# EAGLE design PCB-CMB-4x (EAGLE 7.1.0)

## Sheet 1 of 2
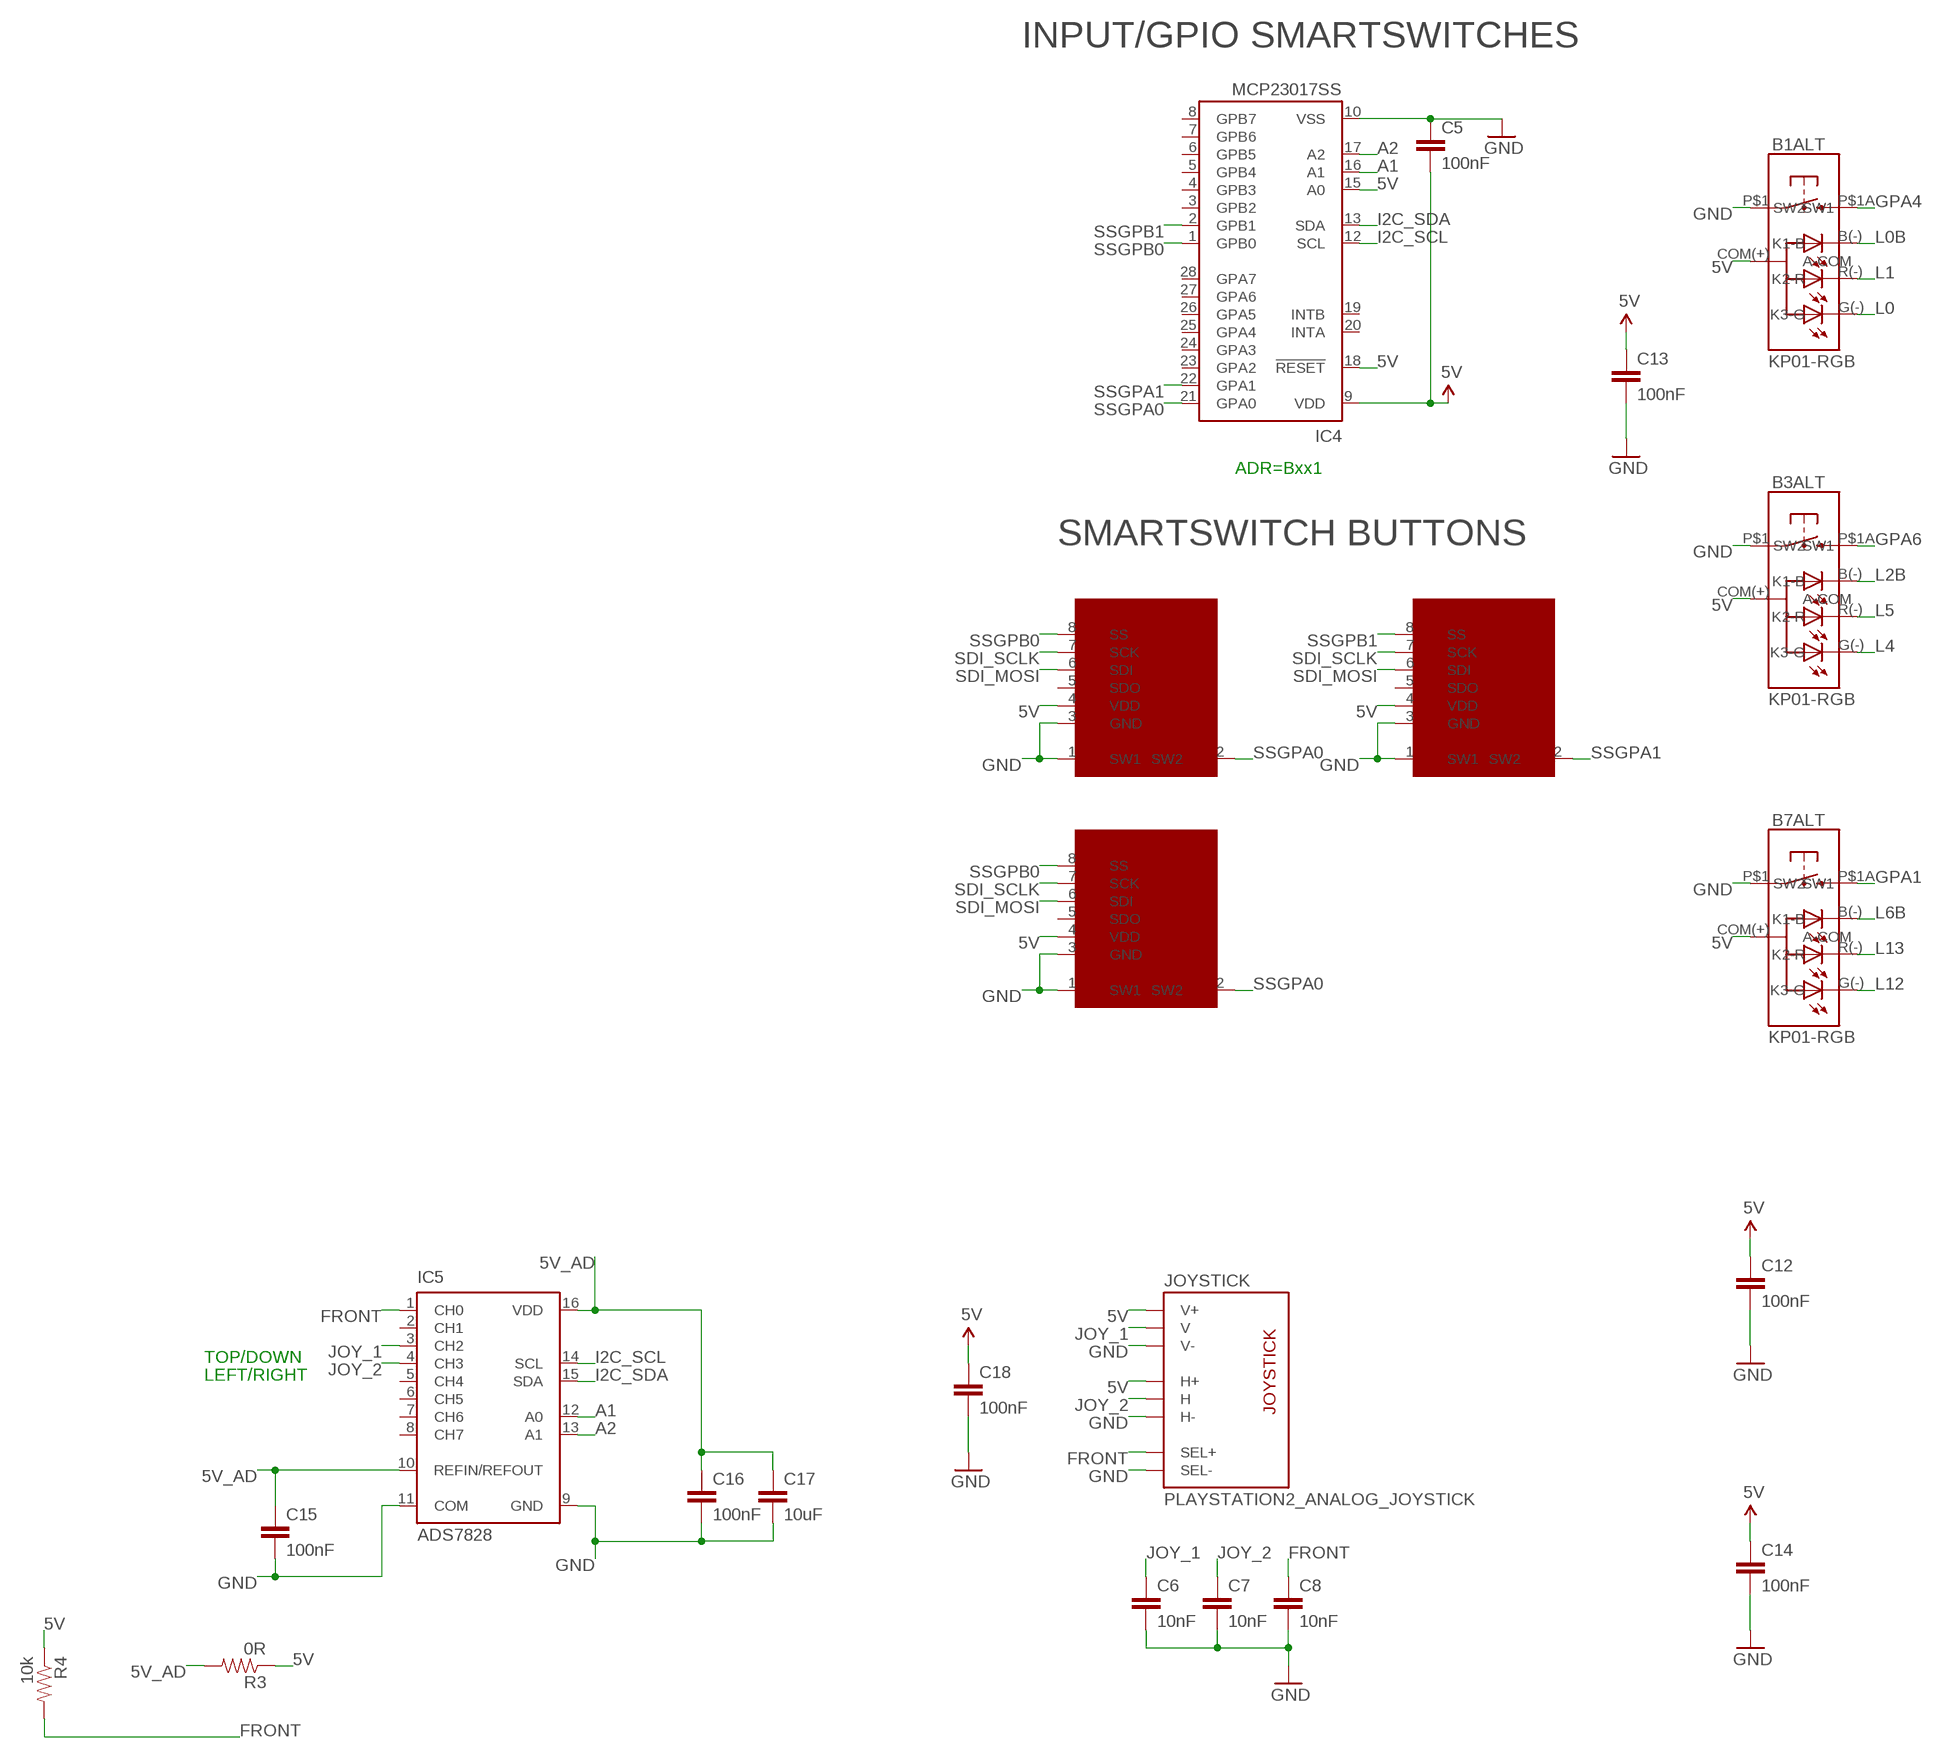
[diagram p0: schematic, sheet 1, part 1 of 2]
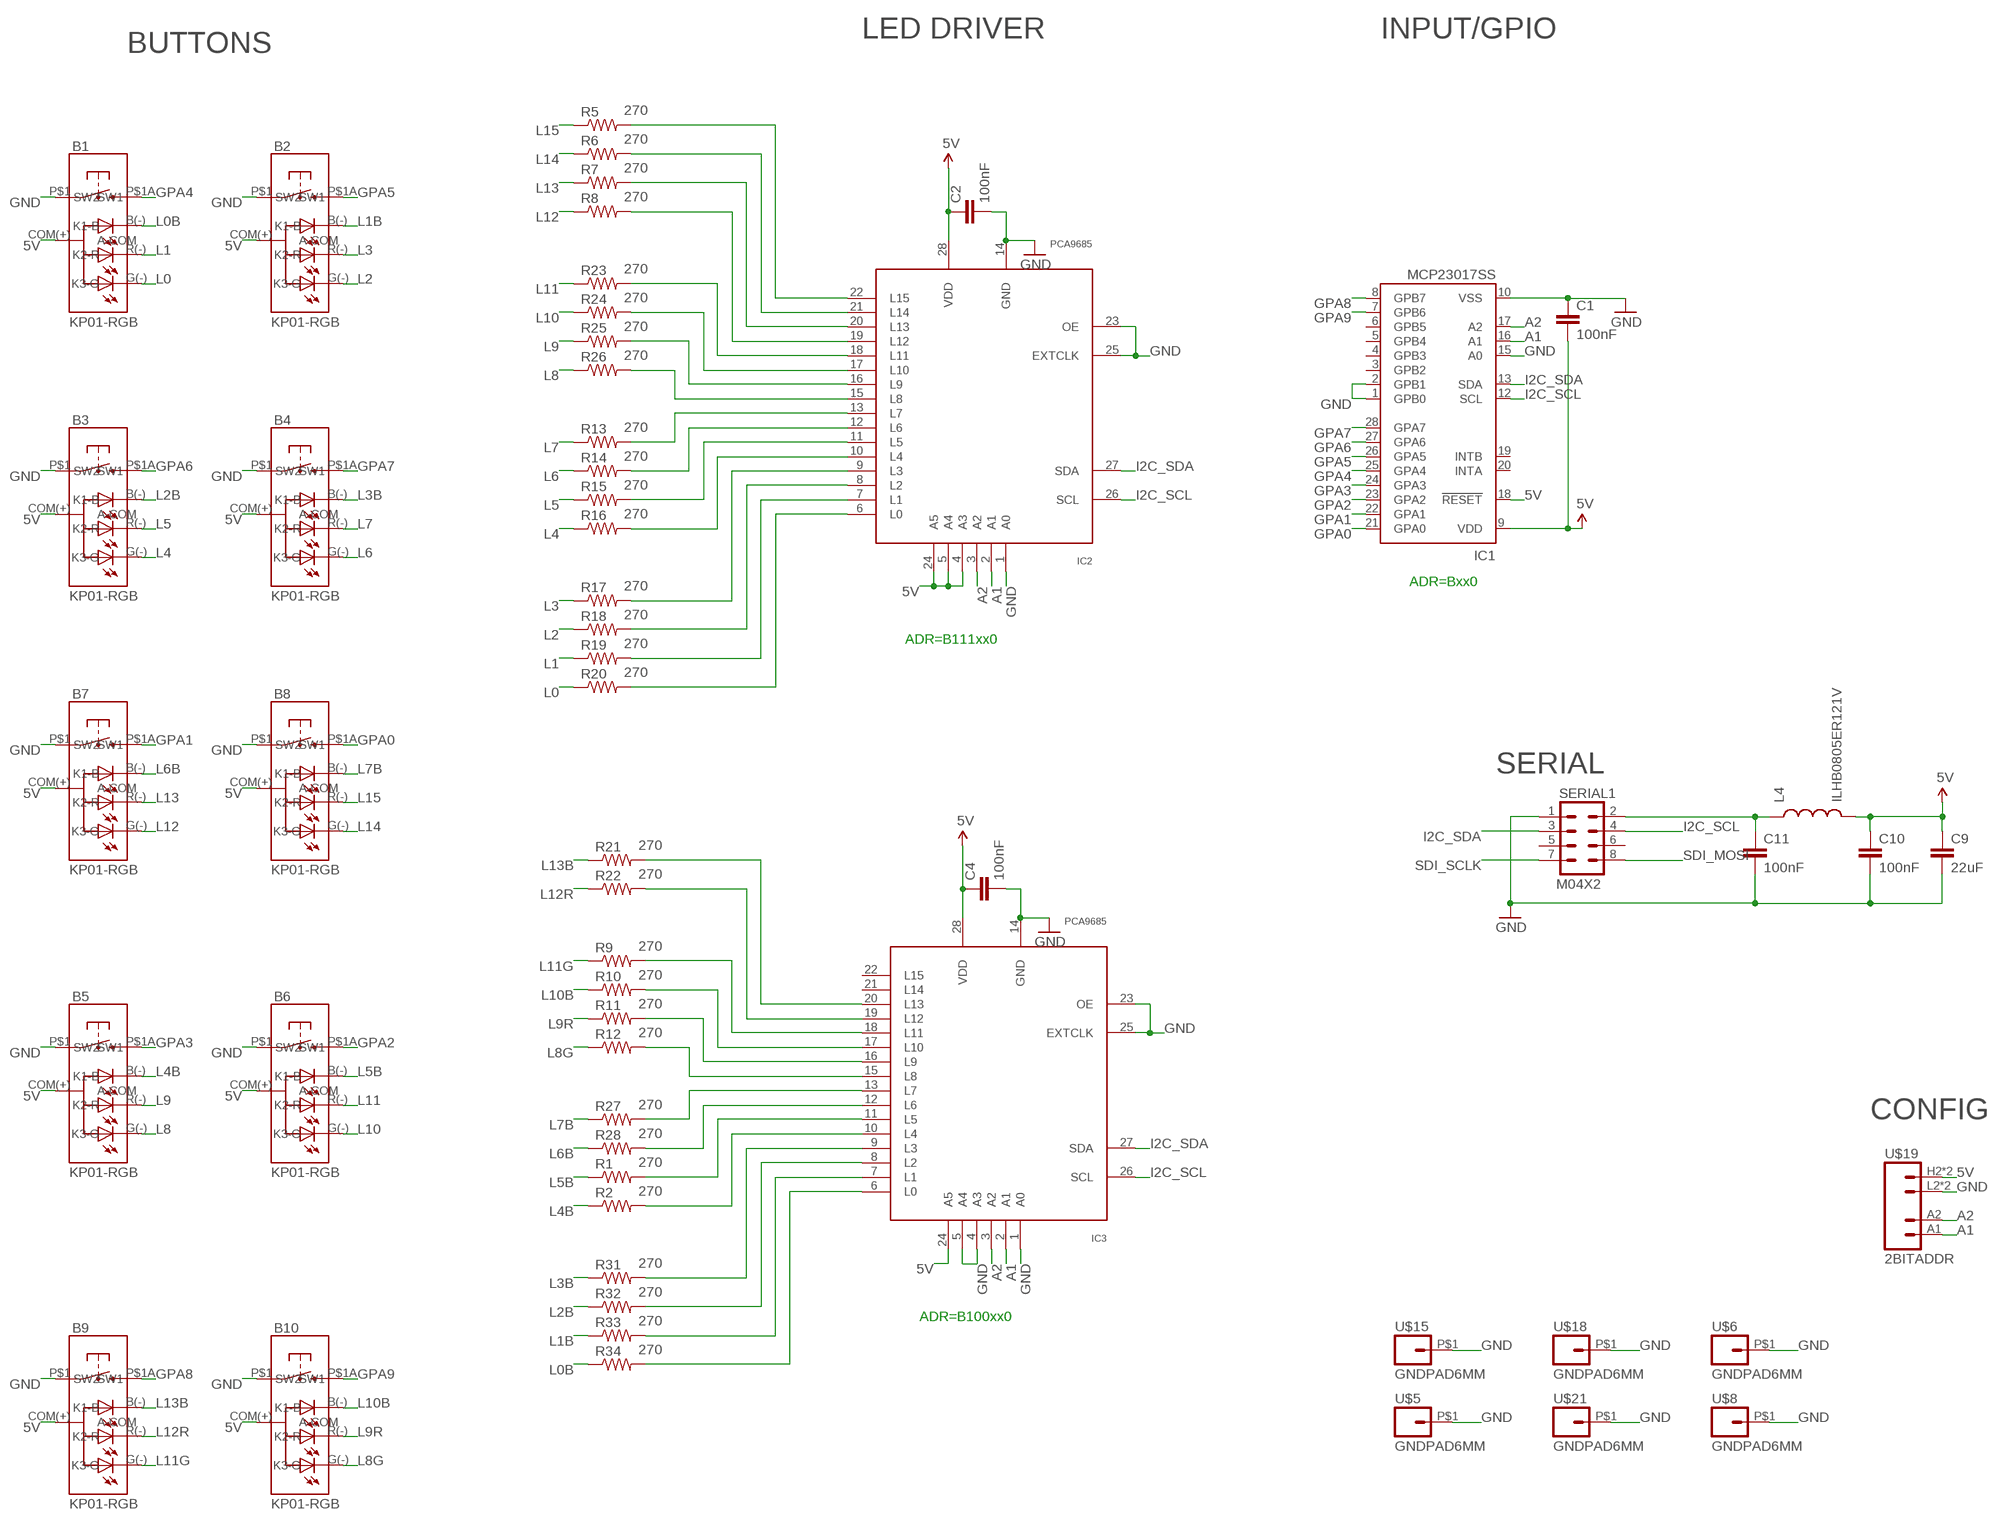
[diagram p1: schematic, sheet 1, part 2 of 2]

### Parts
B1  KP01-RGB  NKK-KP01  [NKK-KP01]
B1ALT  KP01-RGB  NKK-KP01  [NKK-KP01]
B2  KP01-RGB  NKK-KP01  [NKK-KP01]
B3  KP01-RGB  NKK-KP01  [NKK-KP01]
B3ALT  KP01-RGB  NKK-KP01  [NKK-KP01]
B4  KP01-RGB  NKK-KP01  [NKK-KP01]
B5  KP01-RGB  NKK-KP01  [NKK-KP01]
B6  KP01-RGB  NKK-KP01  [NKK-KP01]
B7  KP01-RGB  NKK-KP01  [NKK-KP01]
B7ALT  KP01-RGB  NKK-KP01  [NKK-KP01]
B8  KP01-RGB  NKK-KP01  [NKK-KP01]
B9  KP01-RGB  NKK-KP01  [NKK-KP01]
B10  KP01-RGB  NKK-KP01  [NKK-KP01]
C1  100nF  CAP0603-CAP  [0603-CAP]
C2  100nF  CAP0603-CAP  [0603-CAP]
C4  100nF  CAP0603-CAP  [0603-CAP]
C5  100nF  CAP0603-CAP  [0603-CAP]
C6  10nF  CAP0603-CAP  [0603-CAP]
C7  10nF  CAP0603-CAP  [0603-CAP]
C8  10nF  CAP0603-CAP  [0603-CAP]
C9  22uF  CAP0805  [0805]
C10  100nF  CAP0603-CAP  [0603-CAP]
C11  100nF  CAP0603-CAP  [0603-CAP]
C12  100nF  CAP0603-CAP  [0603-CAP]
C13  100nF  CAP0603-CAP  [0603-CAP]
C14  100nF  CAP0603-CAP  [0603-CAP]
C15  100nF  CAP0603-CAP  [0603-CAP]
C16  100nF  CAP0603-CAP  [0603-CAP]
C17  10uF  CAP0805  [0805]
C18  100nF  CAP0603-CAP  [0603-CAP]
IC1  MCP23017SS  [SSOP28]
IC2  PCA9685  [TSSOP28]
IC3  PCA9685  [TSSOP28]
IC4  MCP23017SS  [SSOP28]
IC5  ADS7828  [TSSOP16-PW]
JOYSTICK  PLAYSTATION2_ANALOG_JOYSTICK  [PLAYSTATION2_ANALOG_JOYSTICK]
L4  ILHB0805ER121V  INDUCTOR0805  [0805]
R1  270  RESISTOR0603-RES  [0603-RES]
R2  270  RESISTOR0603-RES  [0603-RES]
R3  0R  RESISTOR0603-RES  [0603-RES]
R4  10k  RESISTOR0603-RES  [0603-RES]
R5  270  RESISTOR0603-RES  [0603-RES]
R6  270  RESISTOR0603-RES  [0603-RES]
R7  270  RESISTOR0603-RES  [0603-RES]
R8  270  RESISTOR0603-RES  [0603-RES]
R9  270  RESISTOR0603-RES  [0603-RES]
R10  270  RESISTOR0603-RES  [0603-RES]
R11  270  RESISTOR0603-RES  [0603-RES]
R12  270  RESISTOR0603-RES  [0603-RES]
R13  270  RESISTOR0603-RES  [0603-RES]
R14  270  RESISTOR0603-RES  [0603-RES]
R15  270  RESISTOR0603-RES  [0603-RES]
R16  270  RESISTOR0603-RES  [0603-RES]
R17  270  RESISTOR0603-RES  [0603-RES]
R18  270  RESISTOR0603-RES  [0603-RES]
R19  270  RESISTOR0603-RES  [0603-RES]
R20  270  RESISTOR0603-RES  [0603-RES]
R21  270  RESISTOR0603-RES  [0603-RES]
R22  270  RESISTOR0603-RES  [0603-RES]
R23  270  RESISTOR0603-RES  [0603-RES]
R24  270  RESISTOR0603-RES  [0603-RES]
R25  270  RESISTOR0603-RES  [0603-RES]
R26  270  RESISTOR0603-RES  [0603-RES]
R27  270  RESISTOR0603-RES  [0603-RES]
R28  270  RESISTOR0603-RES  [0603-RES]
R31  270  RESISTOR0603-RES  [0603-RES]
R32  270  RESISTOR0603-RES  [0603-RES]
R33  270  RESISTOR0603-RES  [0603-RES]
R34  270  RESISTOR0603-RES  [0603-RES]
SERIAL1  M04X2  [2X4]
SSW1  SMART_SWITCHSMART_SWITCH_8PIN  [SMART_SWITCH]
SSW1ALT  SMART_SWITCHSMART_SWITCH_8PIN  [SMART_SWITCH]
SSW2  SMART_SWITCHSMART_SWITCH_8PIN  [SMART_SWITCH]
U$5  GNDPAD6MM  [3.2MMPAD6MM]
U$6  GNDPAD6MM  [3.2MMPAD6MM]
U$8  GNDPAD6MM  [3.2MMPAD6MM]
U$15  GNDPAD6MM  [3.2MMPAD6MM]
U$18  GNDPAD6MM  [3.2MMPAD6MM]
U$19  2BITADDR  [2BITADDR]
U$21  GNDPAD6MM  [3.2MMPAD6MM]

### Nets
5V [Power]: B1.COM(+)(A-COM) B1ALT.COM(+)(A-COM) B2.COM(+)(A-COM) B3.COM(+)(A-COM) B3ALT.COM(+)(A-COM) B4.COM(+)(A-COM) B5.COM(+)(A-COM) B6.COM(+)(A-COM) B7.COM(+)(A-COM) B7ALT.COM(+)(A-COM) B8.COM(+)(A-COM) B9.COM(+)(A-COM) B10.COM(+)(A-COM) C1.2 C2.1 C4.1 C5.2 C9.1 C10.1 C12.1 C13.1 C14.1 C18.1 IC1.9(VDD) IC1.18(!RESET) IC2.4(A3) IC2.5(A4) IC2.24(A5) IC2.28(VDD) IC3.24(A5) IC3.28(VDD) IC4.9(VDD) IC4.15(A0) IC4.18(!RESET) JOYSTICK.H1(H+) JOYSTICK.V1(V+) L4.2 R3.1 R4.1 SSW1.4(VDD) SSW1ALT.4(VDD) SSW2.4(VDD) U$19.H2(VCC) U$19.H3(VCC)
5V_AD [Power]: C15.1 C16.1 C17.1 IC5.10(REFIN/REFOUT) IC5.16(VDD) R3.2
A1: IC1.16(A1) IC2.2(A1) IC3.2(A1) IC4.16(A1) IC5.12(A0) U$19.A1
A2: IC1.17(A2) IC2.3(A2) IC3.3(A2) IC4.17(A2) IC5.13(A1) U$19.A2
FRONT: C8.1 IC5.1(CH0) JOYSTICK.B1A(SEL+) R4.2
GND [Power]: B1.P$1(SW1) B1ALT.P$1(SW1) B2.P$1(SW1) B3.P$1(SW1) B3ALT.P$1(SW1) B4.P$1(SW1) B5.P$1(SW1) B6.P$1(SW1) B7.P$1(SW1) B7ALT.P$1(SW1) B8.P$1(SW1) B9.P$1(SW1) B10.P$1(SW1) C1.1 C2.2 C4.2 C5.1 C6.2 C7.2 C8.2 C9.2 C10.2 C11.2 C12.2 C13.2 C14.2 C15.2 C16.2 C17.2 C18.2 IC1.1(GPB0) IC1.2(GPB1) IC1.10(VSS) IC1.15(A0) IC2.1(A0) IC2.14(GND) IC2.23(OE) IC2.25(EXTCLK) IC3.1(A0) IC3.4(A3) IC3.5(A4) IC3.14(GND) IC3.23(OE) IC3.25(EXTCLK) IC4.10(VSS) IC5.9(GND) IC5.11(COM) JOYSTICK.B2A(SEL-) JOYSTICK.H3(H-) JOYSTICK.V3(V-) SERIAL1.1 SSW1.1(SW1) SSW1.3(GND) SSW1ALT.1(SW1) SSW1ALT.3(GND) SSW2.1(SW1) SSW2.3(GND) U$5.P$1 U$6.P$1 U$8.P$1 U$15.P$1 U$18.P$1 U$19.L2(GND) U$19.L3(GND) U$21.P$1
GPA0: B8.P$1A(SW2) IC1.21(GPA0)
GPA1: B7.P$1A(SW2) B7ALT.P$1A(SW2) IC1.22(GPA1)
GPA2: B6.P$1A(SW2) IC1.23(GPA2)
GPA3: B5.P$1A(SW2) IC1.24(GPA3)
GPA4: B1.P$1A(SW2) B1ALT.P$1A(SW2) IC1.25(GPA4)
GPA5: B2.P$1A(SW2) IC1.26(GPA5)
GPA6: B3.P$1A(SW2) B3ALT.P$1A(SW2) IC1.27(GPA6)
GPA7: B4.P$1A(SW2) IC1.28(GPA7)
GPA8: B9.P$1A(SW2) IC1.8(GPB7)
GPA9: B10.P$1A(SW2) IC1.7(GPB6)
I2C_SCL: IC1.12(SCL) IC2.26(SCL) IC3.26(SCL) IC4.12(SCL) IC5.14(SCL) SERIAL1.4
I2C_SDA: IC1.13(SDA) IC2.27(SDA) IC3.27(SDA) IC4.13(SDA) IC5.15(SDA) SERIAL1.3
JOY_1: C6.1 IC5.3(CH2) JOYSTICK.V2(V)
JOY_2: C7.1 IC5.4(CH3) JOYSTICK.H2(H)
L0: B1.G(-)(K3-G) B1ALT.G(-)(K3-G) R20.1
L0B: B1.B(-)(K1-B) B1ALT.B(-)(K1-B) R34.1
L1: B1.R(-)(K2-R) B1ALT.R(-)(K2-R) R19.1
L1B: B2.B(-)(K1-B) R33.1
L2: B2.G(-)(K3-G) R18.1
L2B: B3.B(-)(K1-B) B3ALT.B(-)(K1-B) R32.1
L3: B2.R(-)(K2-R) R17.1
L3B: B4.B(-)(K1-B) R31.1
L4: B3.G(-)(K3-G) B3ALT.G(-)(K3-G) R16.1
L4B: B5.B(-)(K1-B) R2.1
L5: B3.R(-)(K2-R) B3ALT.R(-)(K2-R) R15.1
L5B: B6.B(-)(K1-B) R1.1
L6: B4.G(-)(K3-G) R14.1
L6B: B7.B(-)(K1-B) B7ALT.B(-)(K1-B) R28.1
L7: B4.R(-)(K2-R) R13.1
L7B: B8.B(-)(K1-B) R27.1
L8: B5.G(-)(K3-G) R26.1
L8G: B10.G(-)(K3-G) R12.1
L9: B5.R(-)(K2-R) R25.1
L9R: B10.R(-)(K2-R) R11.1
L10: B6.G(-)(K3-G) R24.1
L10B: B10.B(-)(K1-B) R10.1
L11: B6.R(-)(K2-R) R23.1
L11G: B9.G(-)(K3-G) R9.1
L12: B7.G(-)(K3-G) B7ALT.G(-)(K3-G) R8.1
L12R: B9.R(-)(K2-R) R22.1
L13: B7.R(-)(K2-R) B7ALT.R(-)(K2-R) R7.1
L13B: B9.B(-)(K1-B) R21.1
L14: B8.G(-)(K3-G) R6.1
L15: B8.R(-)(K2-R) R5.1
N$1 [Power]: C11.1 L4.1 SERIAL1.2
N$2: IC3.13(L7) R27.2
N$3: IC3.12(L6) R28.2
N$4: IC2.13(L7) R13.2
N$5: IC2.12(L6) R14.2
N$6: IC3.11(L5) R1.2
N$7: IC2.11(L5) R15.2
N$8: IC3.15(L8) R12.2
N$9: IC2.10(L4) R16.2
N$10: IC2.9(L3) R17.2
N$11: IC2.8(L2) R18.2
N$12: IC2.7(L1) R19.2
N$13: IC3.10(L4) R2.2
N$14: IC3.9(L3) R31.2
N$15: IC3.8(L2) R32.2
N$16: IC3.7(L1) R33.2
N$17: IC3.6(L0) R34.2
N$18: IC3.16(L9) R11.2
N$19: IC2.6(L0) R20.2
N$20: IC2.15(L8) R26.2
N$21: IC2.16(L9) R25.2
N$22: IC2.17(L10) R24.2
N$23: IC2.18(L11) R23.2
N$24: IC2.19(L12) R8.2
N$25: IC2.20(L13) R7.2
N$26: IC2.21(L14) R6.2
N$27: IC2.22(L15) R5.2
N$28: IC3.17(L10) R10.2
N$29: IC3.18(L11) R9.2
N$30: IC3.19(L12) R22.2
N$31: IC3.20(L13) R21.2
SDI_MOSI: SERIAL1.8 SSW1.6(SDI) SSW1ALT.6(SDI) SSW2.6(SDI)
SDI_SCLK: SERIAL1.7 SSW1.7(SCK) SSW1ALT.7(SCK) SSW2.7(SCK)
SSGPA0: IC4.21(GPA0) SSW1.2(SW2) SSW1ALT.2(SW2)
SSGPA1: IC4.22(GPA1) SSW2.2(SW2)
SSGPB0: IC4.1(GPB0) SSW1.8(SS) SSW1ALT.8(SS)
SSGPB1: IC4.2(GPB1) SSW2.8(SS)
Unconnected: IC1.3(GPB2) IC1.4(GPB3) IC1.5(GPB4) IC1.6(GPB5) IC1.19(INTB) IC1.20(INTA) IC3.21(L14) IC3.22(L15) IC4.3(GPB2) IC4.4(GPB3) IC4.5(GPB4) IC4.6(GPB5) IC4.7(GPB6) IC4.8(GPB7) IC4.19(INTB) IC4.20(INTA) IC4.23(GPA2) IC4.24(GPA3) IC4.25(GPA4) IC4.26(GPA5) IC4.27(GPA6) IC4.28(GPA7) IC5.2(CH1) IC5.5(CH4) IC5.6(CH5) IC5.7(CH6) IC5.8(CH7) SERIAL1.5 SERIAL1.6 SSW1.5(SDO) SSW1ALT.5(SDO) SSW2.5(SDO)

### Notes on the sheet
- LED DRIVER | INPUT/GPIO
- BUTTONS
- INPUT/GPIO SMARTSWITCHES
- ADR=Bxx1
- SMARTSWITCH BUTTONS
- ADR=Bxx0
- ADR=B111xx0
- SERIAL
- CONFIG
- TOP/DOWN
- LEFT/RIGHT
- ADR=B100xx0

## Sheet 2 of 2

## Library data of the parts
B1 B1ALT B2 B3 B3ALT B4-B7 B7ALT B8-B10 = SKAARHOJ:NKK-KP01: NKK-KP01-15AC 100mA12VDC
C1 C2 C4-C18 = SparkFun:CAP: Capacitor Standard 0603 ceramic capacitor, and 0.1" leaded capacitor.
IC1 IC4 = microchip:MCP23017: http://ww1.microchip.com/downloads/en/DeviceDoc/21952a.pdf Source: http://ww1.microchip.com/downloads/en/DeviceDoc/21952a.pdf; MF: MICROCHIP; MPN: MCP23017-E/SS; OC_FARNELL: 1467674; OC_NEWARK: 31K2960
IC2 IC3 = wsmith:PCA9685
IC5 = burr-brown:ADS7828: 12-Bit, 8-Channel Sampling ANALOG-TO-DIGITAL CONVERTER with I2C? Interface Source: www.ti.com .. ADS7828.pdf; MF: TEXAS INSTRUMENTS; MPN: ADS7828E/250; OC_FARNELL: 1470338; OC_NEWARK: 74C7158
JOYSTICK = SKAARHOJ:PLAYSTATION2_ANALOG_JOYSTICK: Playstation2 Analog Joystick with a Switch
L4 = SparkFun:INDUCTOR: Inductors Basic Inductor/Choke - 0603 and 1206. Footprints are not proven and vary greatly between part numbers.
R1-R28 R31-R34 = SparkFun:RESISTOR: Resistor Basic schematic elements and footprints for 0603, 1206, and PTH resistors.
SERIAL1 = SparkFun:M04X2
SSW1 SSW1ALT SSW2 = SKAARHOJ:SMART_SWITCH: SMARTSWITCH IS15DSBFP4RGB www.nkksmartswitch.com
U$5 U$6 U$8 U$15 U$18 U$21 = SKAARHOJ:GNDPAD
U$19 = SKAARHOJ:2BITADDR

## Net classes
0 default: width 0.203 mm, drill 0.4 mm, clearance 0.203 mm
1 Power: width 0.406 mm, drill 0.5 mm, clearance 0.203 mm

## Board
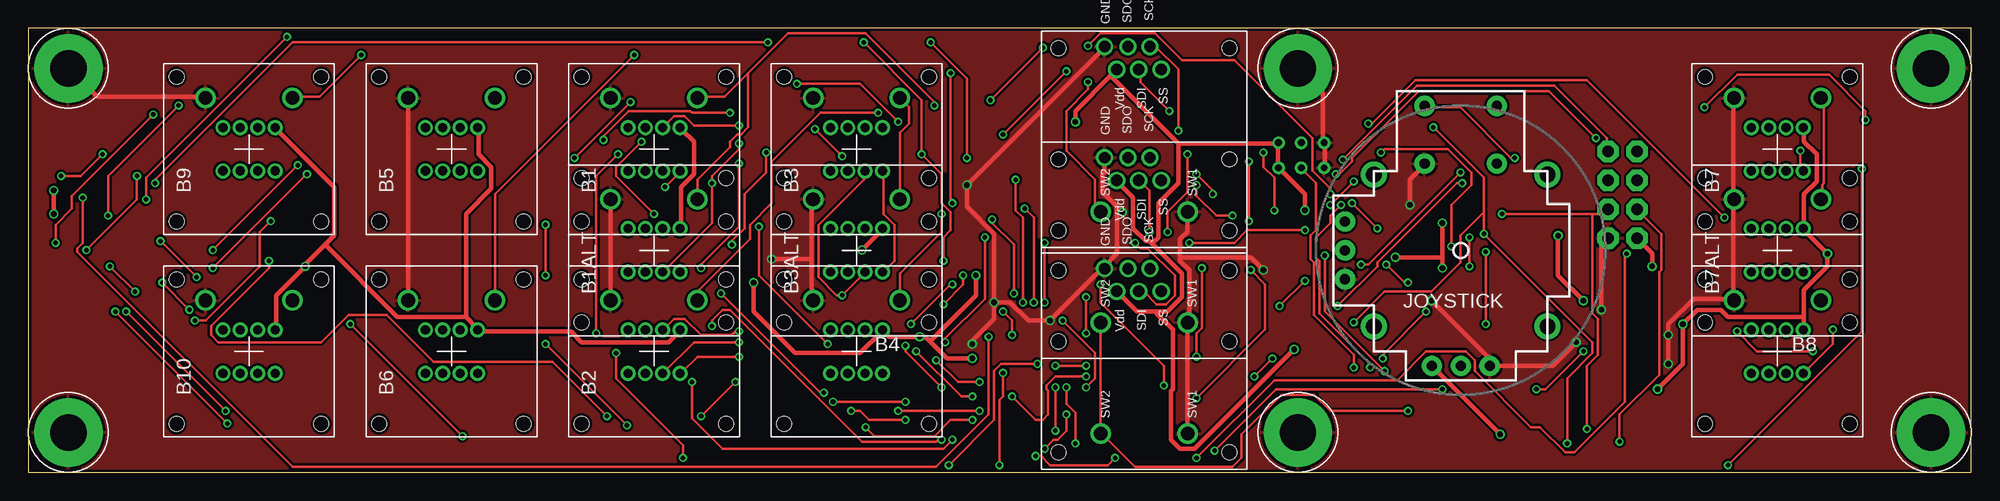
[diagram p2: board, top side]
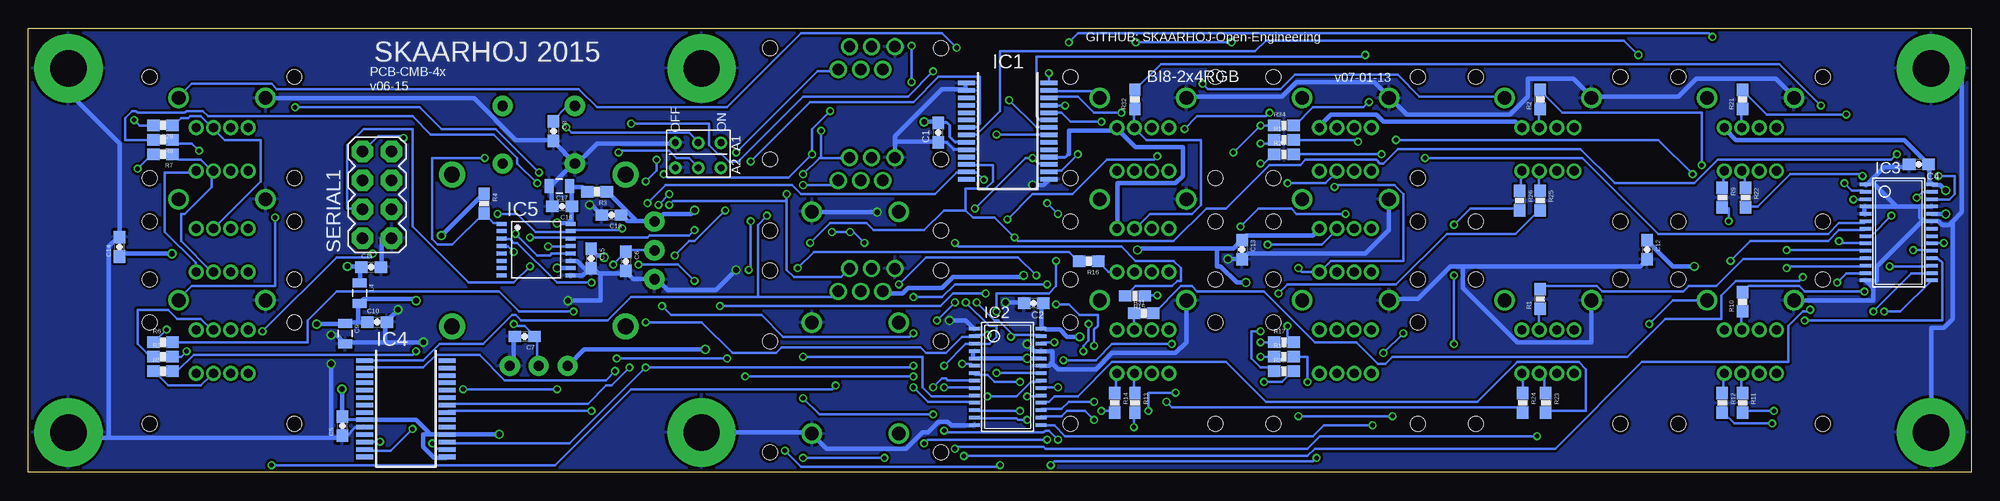
[diagram p3: board, bottom side, seen from below]

Size 170.56 x 39 mm. Coordinates in mm from the lower left corner, seen from the top.
Outline: 0,0 170.56,0 170.56,39 0,39 0,0
Copper layers (1*16): Top 0.035mm / dielectric 1.5mm / Bottom 0.035mm
Design rules "SeeedStudio_2layer_DRU_no_angle_20140221": minimum track width 6mil, minimum drill 12mil, track to track 6mil, track to pad 6mil, pad to pad 6mil, via to via 6mil, smd to smd 0mil, copper to edge 10mil, drill to drill 10mil, minimum pad ring 10mil, minimum via ring 6mil, stop-mask expansion 2mil, vias tented up to drill 100mil, thermal gap 10mil

### Footprints (pad centres in the part's own frame; a part is rotated, then mirrored left to right if it is on the bottom)
NKK-KP01 = drill 0.8: B(-) 1.905,-0.762; COM(+) 1.905,-2.286; G(-) -1.905,-2.286; P$3 1.905,0.762; P$4 1.905,2.286; P$7 -1.905,0.762; P$8 -1.905,2.286; R(-) -1.905,-0.762 | drill 1.2: P$1 4.496,3.81; P$1A 4.496,-3.81 | hole 1.3: -6.35,6.35; 6.35,6.35; 6.35,-6.35; -6.35,-6.35
0603-CAP = smd 1.1 x 1: 1 -0.85,0; 2 0.85,0
0805 = smd 0.8 x 1.2: 1 -0.9,0; 2 0.9,0
SSOP28 = smd 0.4 x 1.5: 1 -4.225,-3.625; 2 -3.575,-3.625; 3 -2.925,-3.625; 4 -2.275,-3.625; 5 -1.625,-3.625; 6 -0.975,-3.625; 7 -0.325,-3.625; 8 0.325,-3.625; 9 0.975,-3.625; 10 1.625,-3.625; 11 2.275,-3.625; 12 2.925,-3.625; 13 3.575,-3.625; 14 4.225,-3.625; 15 4.225,3.625; 16 3.575,3.625; 17 2.925,3.625; 18 2.275,3.625; 19 1.625,3.625; 20 0.975,3.625; 21 0.325,3.625; 22 -0.325,3.625; 23 -0.975,3.625; 24 -1.625,3.625; 25 -2.275,3.625; 26 -2.925,3.625; 27 -3.575,3.625; 28 -4.225,3.625
TSSOP28 = smd 0.305 x 0.991: 1 -4.225,-2.918; 2 -3.575,-2.918; 3 -2.925,-2.918; 4 -2.275,-2.918; 5 -1.625,-2.918; 6 -0.975,-2.918; 7 -0.325,-2.918; 8 0.325,-2.918; 9 0.975,-2.918; 10 1.625,-2.918; 11 2.275,-2.918; 12 2.925,-2.918; 13 3.575,-2.918; 14 4.225,-2.918; 15 4.225,2.918; 16 3.575,2.918; 17 2.925,2.918; 18 2.275,2.918; 19 1.625,2.918; 20 0.975,2.918; 21 0.325,2.918; 22 -0.325,2.918; 23 -0.975,2.918; 24 -1.625,2.918; 25 -2.275,2.918; 26 -2.925,2.918; 27 -3.575,2.918; 28 -4.225,2.918
TSSOP16-PW = smd 0.35 x 0.9: 1 -2.275,-3.025; 2 -1.625,-3.025; 3 -0.975,-3.025; 4 -0.325,-3.025; 5 0.325,-3.025; 6 0.975,-3.025; 7 1.625,-3.025; 8 2.275,-3.025; 9 2.275,3.025; 10 1.625,3.025; 11 0.975,3.025; 12 0.325,3.025; 13 -0.325,3.025; 14 -0.975,3.025; 15 -1.625,3.025; 16 -2.275,3.025
PLAYSTATION2_ANALOG_JOYSTICK = drill 0.9 pad 1.778: B1A -3.175,12.7; B1B 3.175,12.7; B2A -3.175,7.62; B2B 3.175,7.62 | drill 0.889 pad 1.778: H1 -2.54,-10.16; H2 0,-10.16; H3 2.54,-10.16; V1 -10.16,2.54; V2 -10.16,0; V3 -10.16,-2.54 | drill 1.397 pad 2.286: MOUNT1 -7.62,6.668; MOUNT2 -7.62,-6.668; MOUNT3 7.62,-6.668; MOUNT4 7.62,6.668
0603-RES = smd 1.1 x 1: 1 -0.85,0; 2 0.85,0
2X4 = drill 1.016 pad 1.88 octagon: 1 -3.81,-1.27; 2 -3.81,1.27; 3 -1.27,-1.27; 4 -1.27,1.27; 5 1.27,-1.27; 6 1.27,1.27; 7 3.81,-1.27; 8 3.81,1.27
SMART_SWITCH = drill 1.2: 1 6.35,3.81; 2 6.35,-3.81 | drill 1: 3 -8.153,-3.48; 4 -6.147,-2.413; 5 -8.153,-1.422; 6 -6.147,-0.483; 7 -8.153,0.508; 8 -6.147,1.499 | hole 1.3: -8.001,7.506; 8.001,7.506; 8.001,-7.506; -8.001,-7.506
3.2MMPAD6MM = drill 3.2 pad 6: P$1 0,0
2BITADDR = drill 0.6: A1 0,0; A2 2.2,0; H2 0,2; H3 2.2,2; L2 0,-2; L3 2.2,-2

### Placement (x,y rotation side)
B1  54.92,28.39 90 top
B1ALT  54.92,19.5 90 top
B2  54.92,10.61 90 top
B3  72.7,28.39 90 top
B3ALT  72.7,19.5 90 top
B4  72.7,10.61 90 top
B5  37.14,28.39 90 top
B6  37.14,10.61 90 top
B7  153.56,28.39 90 top
B7ALT  153.56,19.5 90 top
B8  153.56,10.61 90 top
B9  19.36,28.39 90 top
B10  19.36,10.61 90 top
C1  90.68,29.84 90 bottom
C2  82.3,14.86 180 bottom
C4  4.57,27.05 180 bottom
C5  143,4.06 90 bottom
C6  118.11,18.54 270 bottom
C7  127,11.94 180 bottom
C8  124.46,29.97 270 bottom
C9  142.75,12.19 270 bottom
C10  139.95,13.21 0 bottom
C11  140.46,18.03 0 bottom
C12  28.45,19.56 270 bottom
C13  64.01,19.56 270 bottom
C14  162.56,19.81 90 bottom
C15  121.16,18.8 270 bottom
C16  123.7,23.37 180 bottom
C17  123.95,25.15 180 bottom
C18  119.38,22.61 180 bottom
IC1  84.58,29.97 270 bottom
IC2  84.58,8.38 270 bottom
IC3  6.35,21.08 270 bottom
IC4  137.41,5.59 270 bottom
IC5  125.98,19.56 270 bottom
JOYSTICK  125.76,19.5 0 top
L4  141.48,15.75 270 bottom
R1  37.85,15.24 90 bottom
R2  37.85,32.77 90 bottom
R3  120.65,24.64 180 bottom
R4  130.56,23.62 270 bottom
R5  158.75,8.89 0 bottom
R6  158.75,11.43 0 bottom
R7  158.75,27.94 180 bottom
R8  158.75,29.21 180 bottom
R9  21.84,24.13 270 bottom
R10  20.07,14.99 90 bottom
R11  20.07,6.1 270 bottom
R12  21.84,6.1 270 bottom
R13  73.41,6.1 270 bottom
R14  75.18,6.1 270 bottom
R15  73.41,15.49 180 bottom
R16  77.47,18.54 180 bottom
R17  60.33,11.43 0 bottom
R18  60.33,10.16 0 bottom
R19  60.33,29.21 0 bottom
R20  60.33,27.94 0 bottom
R21  20.07,32.77 90 bottom
R22  19.81,24.13 270 bottom
R23  37.34,6.1 270 bottom
R24  39.37,6.1 270 bottom
R25  37.85,23.88 270 bottom
R26  39.62,23.88 270 bottom
R27  158.75,10.16 0 bottom
R28  158.75,30.48 180 bottom
R31  72.64,13.97 0 bottom
R32  73.41,32.77 90 bottom
R33  60.33,8.89 0 bottom
R34  60.33,30.48 0 bottom
SERIAL1  139.95,24.38 90 bottom
SSW1  97.96,9.75 270 top
SSW1ALT  97.96,19.5 270 top
SSW2  97.96,29.25 270 top
U$5  3.5,3.5 0 top
U$6  167.06,35.5 0 top
U$8  167.06,3.5 0 top
U$15  3.5,35.5 0 top
U$18  111.46,3.5 0 top
U$19  111.76,28.96 270 bottom
U$21  111.46,35.5 0 top

### Tracks (layer width: path | path; a pad name or v marks a point on that pad's centre or on a via)
5V  (via drill 0.5)
  Top 0.406: B1ALT.COM(+) 57.31,21.43 57.31,25.08 58.42,26.19 58.42,29.05 57.31,30.16 B1.COM(+) | v73.18,19.53 74.93,21.27 B3ALT.COM(+) | B2.COM(+) 57.15,12.38 56.2,11.43 48.58,11.43 47.62,12.38 39.53,12.38 B6.COM(+) 39.37,12.7 38.42,13.65 | v2.22,24.77 v2.22,22.7 | B10.COM(+) 21.75,12.54 21.75,15.56 v24.29,18.1 24.29,18.26 26.04,20 | 26.04,20 26.83,20.8 26.83,25.08 21.75,30.16 B9.COM(+) | 38.42,13.65 32.38,13.65 26.04,20 | 38.42,13.65 38.42,22.7 40.64,24.92 40.64,26.83 39.53,27.94 39.53,30.16 B5.COM(+) | v129.22,3.33 123.35,9.21 JOYSTICK.H1 | v134.3,20.8 134.3,17.3 v136.53,15.08 | 155.89,13.65 155.89,16.03 157.96,18.1 v157.96,19.21 155.89,21.27 B7ALT.COM(+) 155.89,21.59 155.89,24.45 157,25.56 157,27.94 155.89,29.05 155.89,30.16 B7.COM(+) | 155.89,13.65 155.89,12.54 B8.COM(+) | 155.89,13.65 149.22,13.65 148.59,14.29 146.53,14.29 v145.26,13.02 145.26,9.53 v143.03,7.3 | v82.87,10 80.64,10 79.14,11.51 | 79.14,11.51 78.74,11.91 v78.26,11.91 75.56,11.91 75.09,12.38 B4.COM(+) 74.93,12.38 73.03,10.48 67.31,10.48 63.66,14.13 v63.66,16.67 | 99.06,14.13 100.01,14.13 101.28,15.4 101.28,17.46 98.66,20.08 | 99.06,14.13 97.31,14.13 95.57,15.88 SSW1.4 | 98.66,20.08 98.42,20.32 98.11,20.32 97,21.43 97,24.13 95.57,25.56 SSW1ALT.4 | 79.14,11.51 83.19,15.56 v83.19,17.3 | v91.92,30.8 91.92,31.75 95.01,34.85 | 95.01,34.85 95.41,35.24 SSW2.4 | 100.97,28.89 109.54,28.89 U$19.H2 109.7,28.89 109.7,26.83 U$19.H3 109.86,26.67 112.08,24.45 v112.08,23.02 | 95.01,34.85 100.97,28.89 | 98.66,20.08 99.22,20.64 99.22,23.65 100.97,25.4 100.97,28.89 | v111.12,10.79 102.39,2.06 101.12,2.06 100.33,2.86 100.33,7.14 100.49,7.3 100.49,12.54 99.06,13.97 99.06,14.13
  Bottom 0.254: IC4.9 143,4.61 C5.2 | IC1.9 89.19,29 89.66,29.46 89.66,30.48 89.92,30.73 90.64,30.73 C1.2 | IC1.18 79.49,27.7 79.25,27.94
  Bottom 0.406: 79.25,27.94 79.22,27.94 79.22,30 75.25,30 75.09,30.16 B3.COM(+) 74.93,30.16 73.34,28.57 69.22,28.57 69.22,26.04 69.85,25.4 74.93,25.4 74.93,21.43 B3ALT.COM(+) | B1ALT.COM(+) 57.31,21.27 57.78,20.8 63.66,20.8 63.98,20.48 C13.1 64.14,20.32 64.77,19.68 66.2,19.68 | B5.COM(+) 39.53,30.32 40.01,30.8 51.59,30.8 52.23,31.43 56.2,31.43 57.31,30.32 B1.COM(+) | v73.18,19.53 73.03,19.68 66.2,19.68 | v2.22,22.7 3.33,22.7 IC3.24 | v2.22,24.77 2.7,25.24 3.33,25.24 IC3.28 3.49,25.4 3.65,25.4 3.65,26.99 C4.1 3.81,27.15 5.87,29.21 20.64,29.21 21.59,30.16 B9.COM(+) | v24.29,18.1 26.19,18.1 28.42,20.32 C12.1 | 135.41,3.33 133.83,3.33 IC4.18 133.67,3.33 v129.22,3.33 | 135.41,3.33 135.89,3.33 135.89,2.22 134.94,1.27 133.83,1.27 IC4.15 | IC4.9 140.97,4.6 136.53,4.6 135.41,3.49 135.41,3.33 | 141.6,13.18 142.72,13.18 C9.1 142.88,13.02 v145.26,13.02 | 141.6,13.18 140.81,13.18 C10.1 | v134.3,20.8 130.65,24.45 R4.1 | v136.53,15.08 136.68,15.24 141.13,15.24 141.45,14.92 L4.2 141.6,14.76 141.6,13.18 | v157.96,19.21 162.4,19.21 162.56,19.05 C14.1 | v143.03,7.3 143.03,4.92 C5.2 | IC2.24 81.76,10 v82.87,10 87.47,10 IC2.5 87.63,10.16 87.63,10.64 IC2.4 | C2.1 81.6,14.76 81.6,12.7 IC2.28 81.44,12.7 81.28,12.54 80.01,12.54 79.38,11.91 v78.26,11.91 | v83.19,17.3 83.34,17.14 89.38,17.14 90.33,16.19 93.34,16.19 93.82,15.72 95.25,15.72 95.41,15.88 SSW1.4 | 117.32,22.07 115.73,22.07 JOYSTICK.V1 115.41,22.07 114.78,22.7 112.39,22.7 v112.08,23.02 | 117.32,22.07 117.95,22.07 118.43,22.54 C18.1 | R3.1 119.7,24.61 117.32,22.23 117.32,22.07 | v91.92,30.8 90.81,30.8 C1.2 | v111.12,10.79 121.76,10.79 123.19,9.37 JOYSTICK.H1
  Bottom 0.406: 66.2,19.68 66.2,18.1 65.88,18.1 64.45,16.67 v63.66,16.67
5V_AD  (via drill 0.5)
  Top 0.406: v124.14,21.91 124.14,18.89 | 124.14,18.89 v124.14,17.94 | 124.14,18.89 v120.02,18.89
  Bottom 0.406: R3.2 121.6,24.77 121.92,25.08 123.03,25.08 C17.1 122.87,24.92 122.87,23.5 C16.1 122.87,23.18 122.87,22.07 123.03,22.07 123.03,21.91 | v124.14,17.94 123.03,17.94 IC5.10 | 123.03,21.91 v124.14,21.91 | 123.03,21.91 IC5.16 | v120.02,18.89 120.17,19.05 120.65,19.05 121.13,19.53 C15.1
A1  (via drill 0.4)
  Top 0.203: 127.79,22.86 127.79,25.88 v123.35,30.32 | 127.79,22.86 v127.79,20.95 137.32,11.43 137.32,10.48 135.1,8.26 v135.1,2.54 | v116.36,13.18 119.06,15.88 123.19,15.88 125.73,18.41 125.73,20.8 127.79,22.86 | v11.11,25.4 11.11,25.72 23.18,37.78 v64.93,37.78 | v73.34,37.78 78.42,32.7 v78.42,27.94 80.17,26.19 80.17,23.65 80.96,22.86 80.96,21.27 80.33,20.64 v80.33,18.57 | v86.36,12.06 86.36,13.34 v85.57,14.13
  Bottom 0.203: v127.79,20.95 125.89,19.05 124.78,19.05 124.62,19.21 123.03,19.21 IC5.12 | v123.35,30.32 122.87,29.84 112.55,29.84 111.76,29.05 U$19.A1 | v116.36,13.18 111.44,13.18 108.74,10.48 104.93,10.48 104.46,10.95 92.23,10.95 91.76,10.48 90.01,10.48 88.58,11.91 87.63,11.91 IC2.2 87.47,12.06 v86.36,12.06 | v135.1,2.54 134.62,2.06 133.83,2.06 IC4.16 | v11.11,25.4 10.48,24.77 9.53,24.77 9.37,24.61 IC3.2 | v73.34,37.78 v64.93,37.78 | v78.42,27.94 79.85,26.51 80.8,26.51 IC1.16 | v85.57,14.13 85.57,15.72 80.96,15.72 80.33,16.35 v80.33,18.57
A2  (via drill 0.4)
  Top 0.203: v124.94,19.84 124.94,23.5 126.68,25.24 126.68,26.35 124.62,28.42 119.06,28.42 v118.75,28.1 | v116.36,9.21 116.36,10.32 112.87,13.81 112.87,18.41 112.55,18.73 112.55,20.8 113.03,21.27 113.03,25.4 111.76,26.67 U$19.A2 | v10.32,23.97 10.32,25.88 v22.7,38.26 | v79.22,37.78 82.39,34.61 v82.39,27.62 | v88.27,14.92 88.27,22.38 v87.47,23.18 | v90.17,9.37 v92.87,9.37
  Bottom 0.203: v124.94,19.84 123.03,19.84 IC5.13 | v118.75,28.1 118.59,28.26 114.3,28.26 113.67,27.62 112.55,27.62 111.76,26.83 U$19.A2 | IC4.17 133.67,2.54 123.03,2.54 v116.36,9.21 93.03,9.21 v92.87,9.37 | v10.32,23.97 9.37,23.97 IC3.3 | v22.7,38.26 23.02,38.58 78.42,38.58 v79.22,37.78 | IC1.17 80.96,27.15 81.92,27.15 v82.39,27.62 83.03,27.62 v87.47,23.18 | v88.27,14.92 86.2,12.86 85.57,12.86 85.57,11.91 86.2,11.27 87.47,11.27 IC2.3 87.63,11.27 88.27,11.27 v90.17,9.37
FRONT  (via drill 0.4)
  Top 0.203: v130.49,27.62 130.18,27.62 125.73,32.07 122.71,32.07 JOYSTICK.B1A
  Bottom 0.203: IC5.1 129.06,21.91 129.7,21.91 130.49,22.7 R4.2 130.65,22.7 133.35,20 134.62,20 135.1,20.48 135.1,27.62 v130.49,27.62 | C8.1 124.46,30.96 123.35,32.07 122.71,32.07 JOYSTICK.B1A
GND  (via drill 0.5)
  Top 0.406: v138.11,14.29 138.11,20 SERIAL1.1 | v135.89,11.43 133.83,9.37 128.43,9.37 JOYSTICK.H3 128.75,9.53 v123.19,15.08 | B7.P$1 149.7,32.86 149.7,24.13 B7ALT.P$1 149.7,23.97 149.7,15.24 B8.P$1 149.54,15.24 146.21,15.24 143.99,13.02 v143.99,12.06 v143.99,9.53 | v121.28,23.5 121.28,25.72 122.56,26.99 JOYSTICK.B2A | U$19.L3 113.82,26.83 113.82,28.89 U$19.L2 113.67,29.05 113.67,33.34 111.6,35.4 U$21.P$1 | v84.77,14.92 86.2,14.92 87.79,13.34 v89.69,13.34 94.14,17.78 94.46,17.78 SSW1.3 94.46,18.1 95.57,19.21 95.57,22.86 | v84.77,14.92 84.77,20.95 82.39,23.34 v82.39,25.24 94.46,37.31 SSW2.3 | 95.57,22.86 95.57,23.34 94.3,24.61 94.3,26.19 94.46,26.35 94.46,27.62 SSW1ALT.3 | SSW1.1 101.76,3.49 101.76,13.02 SSW1ALT.1 101.92,13.18 101.92,17.78 101.12,18.57 101.12,18.89 | 101.12,18.89 101.12,20.48 101.76,21.11 101.76,22.86 SSW2.1 | v96.04,22.86 95.57,22.86 | B9.P$1 15.4,33.02 6.03,33.02 3.65,35.4 U$15.P$1 | 68.74,18.73 68.74,15.24 B4.P$1 | 68.74,18.73 68.74,23.97 B3ALT.P$1 | B6.P$1 33.34,15.24 33.34,32.86 B5.P$1 | B1ALT.P$1 51.12,23.97 51.12,15.24 B2.P$1 | v65.25,18.73 68.74,18.73 | v84.77,14.92 84.77,13.49 82.87,11.59 v82.87,11.27 | v108.43,17.78 107.31,18.89 101.12,18.89
  Bottom 0.254: C5.1 142.58,3.21 141.86,3.94 141.06,3.94 IC4.10 | IC1.10 89.31,28.35 89.92,28.96 90.64,28.96 C1.1
  Bottom 0.406: U$6.P$1 167,35.4 167,33.34 162.56,28.89 C14.2 162.72,20.64 163.51,19.84 163.51,3.02 | 163.51,3.02 166.53,3.02 167,3.49 U$8.P$1 | 163.51,3.02 143.99,3.02 | 143.99,3.02 143.19,3.02 143.03,3.17 C5.1 | IC5.9 122.87,17.3 121.92,17.3 121.28,17.94 C15.2 | IC5.11 122.87,18.57 122.4,18.57 121.6,17.78 C15.2 | 120.33,17.46 118.11,17.46 C6.2 118.11,17.62 117.47,16.99 115.73,16.99 JOYSTICK.V3 115.41,16.99 114.46,16.03 110.17,16.03 v108.43,17.78 | 120.33,17.46 120.49,17.46 120.97,17.94 C15.2 | C7.2 127.95,11.91 127.95,9.37 128.27,9.37 JOYSTICK.H3 | 139.22,11.43 139.22,13.18 C10.2 139.06,13.34 v138.11,14.29 | 139.22,11.43 142.72,11.43 C9.2 142.88,11.43 143.51,12.06 v143.99,12.06 | C11.2 139.54,18.1 139.54,20.48 138.75,20.48 SERIAL1.1 | 139.22,11.43 v135.89,11.43 | 120.33,17.46 120.33,15.08 v123.19,15.08 | C16.2 124.62,23.5 124.62,25.08 124.78,25.08 C17.2 124.62,25.24 122.87,26.99 122.71,26.99 JOYSTICK.B2A | v121.28,23.5 121.13,23.5 120.33,22.7 C18.2 | JOYSTICK.B2A 122.56,27.15 124.46,29.05 C8.2 124.62,29.21 127.79,29.21 131.44,32.86 149.7,32.86 B7.P$1 | JOYSTICK.B2A 122.4,27.15 120.65,28.89 113.82,28.89 U$19.L2 | v143.99,9.53 143.99,3.02 | IC1.1 88.27,34.13 88.27,33.66 IC1.2 88.42,33.66 90.33,33.66 94.46,29.53 94.46,29.05 | 94.46,29.05 94.46,27.78 SSW1ALT.3 | 94.46,29.05 90.81,29.05 C1.1 | v89.69,13.34 88.27,13.34 87.63,12.7 IC2.1 | v84.77,14.92 83.19,14.92 C2.2 | v82.39,25.24 81.44,25.24 80.96,25.72 IC1.15 | IC2.14 87.63,4.13 89.53,4.13 89.85,4.45 90.65,4.45 91.6,3.49 92.08,3.49 93.5,2.06 100.49,2.06 101.76,3.33 SSW1.1 101.92,3.49 111.44,3.49 U$18.P$1 | v96.04,22.86 101.76,22.86 SSW2.1
  Bottom 0.406: 8.81,25.64 7.62,26.83 5.71,26.83 5.56,26.99 C4.2 | 8.81,25.64 9.21,25.24 IC3.1 | IC3.5 9.37,22.7 9.37,23.34 IC3.4 9.21,23.34 6.67,23.34 | 4.13,22.07 3.49,22.07 IC3.23 3.33,22.07 2.86,22.07 2.54,21.75 1.91,21.75 1.67,21.99 | 4.13,22.07 4.45,22.38 4.45,23.34 | 4.45,23.34 3.49,23.34 IC3.25 | 4.45,23.34 6.67,23.34 | 8.81,25.64 6.67,23.5 6.67,23.34 | B10.P$1 15.4,15.08 8.57,15.08 8.57,16.19 9.21,16.83 IC3.14 9.05,16.83 8.26,16.83 8.26,18.1 4.29,22.07 4.13,22.07 | 1.67,21.99 0.79,22.86 0.79,35.4 3.49,35.4 U$15.P$1 | U$5.P$1 3.49,3.65 3.49,12.7 2.38,12.7 1.59,13.49 1.59,21.91 1.67,21.99 | 80.72,9.6 80.64,9.68 80.64,10.64 81.6,10.64 IC2.25 81.76,10.64 82.23,10.64 v82.87,11.27 | 80.72,9.6 80.96,9.37 81.6,9.37 IC2.23 | 80.72,9.6 80.17,9.05 76.83,9.05 75.41,10.48 69.85,10.48 68.9,11.43 68.9,15.08 B4.P$1 | B3.P$1 68.74,33.02 60.48,33.02 59.21,34.29 52.39,34.29 51.12,33.02 B1.P$1 50.96,32.86 49.53,31.43 40.48,31.43 38.89,33.02 38.89,34.61 34.92,34.61 33.34,33.02 B5.P$1 33.18,33.02 25.72,33.02 24.13,34.61 17.14,34.61 15.56,33.02 B9.P$1 | B1ALT.P$1 51.12,23.97 51.12,21.27 53.18,19.21 63.5,19.21 63.98,18.73 C13.2 64.14,18.73 v65.25,18.73 | 44.61,18.1 45.72,18.1 48.58,15.24 50.96,15.24 B2.P$1 | 44.61,18.1 29.05,18.1 28.57,18.57 C12.2 | 44.61,18.1 44.61,16.19 39.85,11.43 33.34,11.43 33.34,15.08 B6.P$1
  pour Top: 0,0 170.18,0 170.18,40.64 0,40.64
  pour Bottom: 0,0 170.18,0 170.18,40.64 0,40.64
GPA0  (via drill 0.4)
  Top 0.203: v91.12,35.24 v85.57,29.69 | v117.63,30.64 117.95,30.64 121.76,34.45 136.84,34.45 v148.91,22.38
  Bottom 0.203: v85.57,29.69 80.96,29.69 IC1.21 | v91.12,35.24 93.34,33.02 102.55,33.02 108.27,27.3 109.06,27.3 109.7,27.94 110.01,27.94 110.81,28.73 110.81,30.64 v117.63,30.64 | v148.91,22.38 148.91,16.35 156.21,16.35 157.32,15.24 B8.P$1A
GPA1  (via drill 0.4)
  Top 0.203: v89.06,37.31 v84.45,32.7 | B7ALT.P$1A 157.48,24.13 157.48,25.24 157.64,25.4 157.64,32.7 157.48,32.86 B7.P$1A
  Bottom 0.203: v84.45,32.7 82.07,30.32 80.96,30.32 IC1.22 | v89.06,37.31 90.33,38.58 102.71,38.58 109.22,32.07 120.65,32.07 122.24,33.66 148.75,33.66 149.22,34.13 156.21,34.13 157.32,33.02 B7.P$1A
GPA2  (via drill 0.4)
  Top 0.203: v53.18,36.67 40.96,24.45 40.96,15.24 B6.P$1A
  Bottom 0.203: v53.18,36.67 53.34,36.51 82.07,36.51 82.07,31.27 81.76,30.96 IC1.23
GPA3  (via drill 0.4)
  Top 0.203: v76.36,30.8 73.03,34.13 v67.47,34.13
  Bottom 0.203: v76.36,30.8 79.06,30.8 79.85,31.59 80.8,31.59 IC1.24 | v67.47,34.13 66.99,33.66 60.64,33.66 59.37,34.92 50.32,34.92 48.42,33.02 40.96,33.02 B5.P$1A
GPA4  (via drill 0.4)
  Top 0.203: v79.53,32.23 79.53,32.54 73.5,38.58 66.67,38.58 63.18,35.08 | 63.18,35.08 61.12,33.02 58.74,33.02 B1.P$1A | 63.18,35.08 63.18,30.32 62.55,29.69 62.23,29.69 61.59,29.05 61.59,28.57 58.74,25.72 58.74,24.13 B1ALT.P$1A
  Bottom 0.203: v79.53,32.23 80.8,32.23 IC1.25
GPA5  (via drill 0.4)
  Top 0.203: v74.61,31.59 69.53,31.59 65.25,27.3 65.25,23.65 63.34,21.75 63.34,20.48 58.74,15.88 58.74,15.24 B2.P$1A
  Bottom 0.203: v74.61,31.59 76.99,31.59 78.42,33.02 80.8,33.02 IC1.26
GPA6
  Top 0.203: B3ALT.P$1A 76.52,24.13 76.52,29.84 77.31,30.64 77.31,32.07 76.52,32.86 B3.P$1A
  Bottom 0.203: IC1.27 80.8,33.5 76.99,33.5 76.52,33.02 B3.P$1A
GPA7  (via drill 0.4)
  Top 0.203: v80.96,35.08 80.96,23.81 v81.12,23.65 | v80.17,22.7 80.17,21.11 76.52,17.46 76.52,15.24 B4.P$1A
  Bottom 0.203: v80.96,35.08 80.96,34.29 IC1.28 | v80.17,22.7 v81.12,23.65
GPA8  (via drill 0.4)
  Top 0.203: v29.21,36.67 25.56,33.02 23.18,33.02 B9.P$1A
  Bottom 0.203: v29.21,36.67 30.48,37.94 61.91,37.94 62.87,36.99 85.25,36.99 85.25,31.75 87.31,29.69 88.11,29.69 IC1.8
GPA9  (via drill 0.4)
  Top 0.203: v107.16,22.07 v107.16,27.3 | v107.31,17.78 108.58,16.51 108.58,12.54 v102.55,6.51 | v91.12,5.08 91.12,3.65 90.33,2.86 90.01,2.86 v89.22,2.06 | v28.26,13.02 v38.1,3.17
  Bottom 0.203: v107.16,27.3 101.92,32.54 92.87,32.54 90.65,34.77 87,34.77 87,30.64 87.31,30.32 88.11,30.32 IC1.7 | v107.16,22.07 107.16,17.78 v107.31,17.78 | v102.55,6.51 101.12,5.08 v91.12,5.08 | v89.22,2.06 89.06,2.22 81.44,2.22 81.28,2.06 58.26,2.06 57.15,3.17 v38.1,3.17 | v28.26,13.02 26.19,15.08 23.18,15.08 B10.P$1A
I2C_SCL  (via drill 0.4)
  Top 0.203: v126.52,18.1 v126.52,20.64 | v139.7,2.7 139.7,5.08 143.19,8.57 143.19,17.62 143.35,17.78 143.35,20.95 141.29,23.02 SERIAL1.4 | v80.49,11.43 80.49,11.75 83.98,15.24 v83.98,20.64 | v2.86,26.04 4.6,26.04 v6.51,27.94 | v112.08,21.27 107,21.27 105.89,20.16 v101.92,20.16
  Bottom 0.203: v126.52,20.64 123.03,20.64 IC5.14 122.87,20.64 116.2,20.64 116.05,20.8 112.55,20.8 v112.08,21.27 | v126.52,18.1 127.95,16.67 131.92,16.67 136.84,21.59 136.84,30.16 141.13,30.16 142.56,28.73 142.56,23.18 141.29,23.18 SERIAL1.4 | v139.7,2.7 140.97,2.7 IC4.12 | v80.49,11.43 81.6,11.43 IC2.26 | 88.27,23.02 87.63,22.38 85.72,22.38 v83.98,20.64 83.66,20.32 70.01,20.32 67.15,23.18 65.41,23.18 61.59,26.99 58.9,26.99 58.42,27.46 52.23,27.46 51.91,27.15 51.59,27.15 50.32,28.42 34.29,28.42 31.27,25.4 24.29,25.4 22.23,27.46 6.99,27.46 v6.51,27.94 | 88.27,23.02 88.27,24.92 86.52,24.92 85.88,25.56 85.88,26.99 88.11,26.99 IC1.12 | v2.86,26.04 1.43,26.04 1.43,24.45 1.91,23.97 3.33,23.97 IC3.26 | v101.92,20.16 100.17,21.91 97,21.91 96.36,21.27 91.92,21.27 90.17,23.02 88.27,23.02
I2C_SDA  (via drill 0.4)
  Top 0.203: 137.32,22.7 138.27,22.7 SERIAL1.3 | 137.32,22.7 v129.38,22.7 | v136.84,3.81 136.84,9.37 137.79,10.32 137.79,13.49 137.32,13.97 137.32,22.7 | v87.31,14.92 87.31,22.38 86.68,23.02 v86.68,25.72 | v4.76,24.13 4.76,20.16 4.29,19.68 4.29,19.37 23.18,0.48 79.69,0.48 84.3,5.08 v84.3,11.91 | v116.2,23.65 v118.43,21.43
  Bottom 0.203: v129.38,22.7 127.64,22.7 126.05,21.11 123.03,21.11 IC5.15 122.87,21.27 118.59,21.27 v118.43,21.43 | v136.84,3.81 138.75,1.91 140.97,1.91 IC4.13 | 84.14,12.06 81.76,12.06 IC2.27 | 84.14,12.06 85.41,13.34 85.72,13.34 v87.31,14.92 | v86.68,25.72 87.31,26.35 88.11,26.35 IC1.13 88.27,26.35 89.06,26.35 90.96,24.45 102.71,24.45 103.5,25.24 114.62,25.24 v116.2,23.65 | v4.76,24.13 4.29,24.61 3.49,24.61 IC3.27 | 84.14,12.06 v84.3,11.91
JOY_1  (via drill 0.4)
  Top 0.203: v121.13,16.67 120.81,16.67 v119.22,18.26
  Bottom 0.203: v121.13,16.67 124.14,16.67 127.64,20.16 127.95,20.16 128.27,20.48 128.91,20.48 IC5.3 | v119.22,18.26 118.11,19.37 C6.1 118.11,19.53 115.73,19.53 JOYSTICK.V2
JOY_2  (via drill 0.4)
  Top 0.203: v127.95,13.02 v127.95,19.37
  Bottom 0.203: v127.95,19.37 128.43,19.84 128.91,19.84 IC5.4 | v127.95,13.02 127.79,12.86 127,12.86 126.21,12.06 C7.1 126.05,11.91 125.89,11.91 125.89,9.37 JOYSTICK.H2
L0  (via drill 0.4)
  Top 0.203: v62.39,27.15 62.39,21.59 59.05,18.26 v59.05,17.94 | v55.88,25.08 57.15,26.35 B1.G(-)
  Bottom 0.203: v62.39,27.15 62.07,27.15 61.28,27.94 R20.1 | v59.05,17.94 58.74,17.62 57.31,17.62 B1ALT.G(-) 57.15,17.62 56.2,18.57 49.85,18.57 49.85,24.45 50.64,25.24 55.72,25.24 v55.88,25.08
L0B  (via drill 0.4)
  Top 0.203: v62.39,30.48 58.42,30.48 57.63,31.27 56.67,31.27 55.72,30.32 B1.B(-) | v61.75,20 61.75,20.32 62.87,21.43 62.87,24.45 64.77,26.35 v64.77,28.1
  Bottom 0.203: R34.1 v62.39,30.48 v64.77,28.1 | v61.75,20 56.99,20 55.72,21.27 B1ALT.B(-)
L1  (via drill 0.4)
  Top 0.203: v62.39,28.89 62.39,28.42 60.01,26.04 v60.01,25.4 60.01,21.91 55.72,17.62 B1ALT.R(-)
  Bottom 0.203: v62.39,28.89 61.59,28.89 61.28,29.21 R19.1 | v60.01,25.4 56.67,25.4 55.72,26.35 B1.R(-)
L1B  (via drill 0.4)
  Top 0.203: v62.39,12.38 62.07,12.38 61.75,12.06 59.05,12.06 57.63,13.49 56.67,13.49 55.72,12.54 B2.B(-)
  Bottom 0.203: v62.39,12.38 63.18,12.38 63.18,10 62.39,9.21 61.59,9.21 61.28,8.89 R33.1
L2  (via drill 0.4)
  Top 0.203: v62.39,10.16 58.74,10.16 57.31,8.73 B2.G(-)
  Bottom 0.203: v62.39,10.16 R18.1
L2B
  Bottom 0.203: R32.1 73.5,31.91 73.5,30.32 B3.B(-) 73.34,30.16 72.39,29.21 67.63,29.21 67.63,23.5 68.42,22.7 72.07,22.7 73.34,21.43 B3ALT.B(-)
L3  (via drill 0.4)
  Top 0.203: v62.39,11.43 58.42,11.43 55.72,8.73 B2.R(-)
  Bottom 0.203: v62.39,11.43 R17.1
L3B
  Bottom 0.203: R31.1 73.5,13.97 73.5,12.54 B4.B(-)
L4
  Top 0.203: B3.G(-) 75.09,26.35 75.09,22.7 76.04,21.75 76.04,18.57 75.09,17.62 B3ALT.G(-)
  Bottom 0.203: R16.1 76.52,18.41 75.72,17.62 75.09,17.62 B3ALT.G(-)
L4B
  Bottom 0.203: R2.1 37.94,31.91 37.94,30.32 B5.B(-)
L5  (via drill 0.4)
  Top 0.203: B3ALT.R(-) 73.34,17.46 v71.44,15.56 70.96,15.56 69.37,17.14 69.37,21.75 73.34,25.72 73.34,26.35 B3.R(-)
  Bottom 0.203: v71.44,15.56 72.55,15.56 R15.1
L5B
  Bottom 0.203: R1.1 37.94,14.29 37.94,12.54 B6.B(-)
L6
  Bottom 0.203: R14.1 75.09,6.99 75.09,8.57 B4.G(-)
L6B
  Bottom 0.203: R28.1 157.8,30.48 157.16,31.11 156.53,31.11 156.37,31.27 155.42,31.27 154.46,30.32 B7.B(-) 154.31,30.16 153.35,29.21 150.18,29.21 150.18,25.56 154.31,21.43 B7ALT.B(-)
L7
  Bottom 0.203: R13.1 73.5,6.99 73.5,8.57 B4.R(-)
L7B
  Bottom 0.203: R27.1 159.7,10.16 160.02,10.48 160.18,10.48 160.97,11.27 160.97,14.29 158.27,14.29 157.48,13.49 155.42,13.49 154.46,12.54 B8.B(-)
L8
  Bottom 0.203: R26.1 39.53,24.77 39.53,26.35 B5.G(-)
L8G
  Bottom 0.203: R12.1 21.75,6.99 21.75,8.57 B10.G(-)
L9
  Bottom 0.203: R25.1 37.94,24.77 37.94,26.35 B5.R(-)
L9R
  Bottom 0.203: R11.1 20.16,6.99 20.16,8.57 B10.R(-)
L10
  Bottom 0.203: R24.1 39.37,8.57 B6.G(-)
L10B
  Bottom 0.203: R10.1 20.16,14.13 20.16,12.54 B10.B(-)
L11
  Bottom 0.203: R23.1 37.47,6.99 37.47,8.57 37.78,8.57 B6.R(-)
L11G
  Bottom 0.203: R9.1 21.75,25.08 21.75,26.35 B9.G(-)
L12  (via drill 0.4)
  Top 0.203: v155.57,28.26 155.57,26.67 155.73,26.51 B7.G(-)
  Bottom 0.203: v155.57,28.26 156.21,28.89 157.48,28.89 157.8,29.21 R8.1 | B7ALT.G(-) 155.89,17.62 155.89,18.41 158.59,21.11 158.59,26.35 155.89,26.35 B7.G(-)
L12R
  Bottom 0.203: R22.1 19.84,25.08 19.84,26.35 20,26.35 B9.R(-)
L13
  Bottom 0.203: R7.1 157.8,27.94 157.32,27.46 155.42,27.46 154.46,26.51 B7.R(-) 154.46,26.35 154.46,25.08 156.84,22.7 157.16,22.7 157.16,20.32 154.46,17.62 B7ALT.R(-)
L13B
  Bottom 0.203: R21.1 20.16,31.91 20.16,30.32 B9.B(-)
L14  (via drill 0.4)
  Top 0.203: v158.43,12.54 158.43,11.27 155.89,8.73 B8.G(-)
  Bottom 0.203: v158.43,12.54 159.54,11.43 R6.1
L15
  Bottom 0.203: R5.1 159.54,8.89 158.27,7.62 155.42,7.62 154.46,8.57 B8.R(-)
N$1  (via drill 0.5)
  Top 0.406: v142.56,18.1 142.56,19.21 141.29,20.48 SERIAL1.2
  Bottom 0.406: L4.1 141.45,16.67 141.45,17.94 C11.1 141.6,17.94 141.76,18.1 v142.56,18.1
N$2  (via drill 0.4)
  Top 0.203: v14.13,14.29 v11.75,16.67 | v88.42,1.43 88.9,1.43 89.69,0.64 94.77,0.64 v95.41,1.27 | v102.55,1.27 109.38,8.1 120.17,8.1 122.71,10.64 126.21,10.64 127,9.84 127,8.89 131.92,3.97 132.72,3.97 134.94,1.75 135.73,1.75 140.18,6.19 140.18,19.05 v140.34,19.21 | v150.02,12.38 151.76,10.64 v156.69,10.64
  Bottom 0.203: v11.75,16.67 10.95,17.46 9.37,17.46 IC3.13 | v14.13,14.29 14.29,14.13 14.76,14.13 16.03,12.86 16.03,9.68 28.89,9.68 36.51,2.06 57.63,2.06 58.26,1.43 v88.42,1.43 | v102.55,1.27 v95.41,1.27 | v140.34,19.21 140.65,18.89 143.51,18.89 v150.02,12.38 | v156.69,10.64 157.16,10.16 R27.2
N$3  (via drill 0.4)
  Top 0.203: v24.45,26.19 v16.19,17.94 | v50.48,29.21 50.48,29.53 52.7,31.75 58.1,31.75 58.26,31.59 v61.59,31.59 | v71.44,27.78 v69.06,30.16 | v84.61,22.23 84.61,21.91 86.52,20 v86.52,15.72 | v112.08,16.83 v109.86,14.61 | v117,18.26 117.63,18.26 v125.73,26.35 | v147.16,32.07 150.02,34.92 158.12,34.92 161.29,31.75 v161.29,30.96
  Bottom 0.203: v16.19,17.94 16.03,18.1 9.37,18.1 IC3.12 | v24.45,26.19 27.46,29.21 v50.48,29.21 | v61.59,31.59 61.91,31.27 67.94,31.27 v69.06,30.16 | v71.44,27.78 71.75,27.46 75.88,27.46 78.9,24.45 82.39,24.45 v84.61,22.23 | v86.52,15.72 89.38,15.72 90.49,14.61 v109.86,14.61 | v112.08,16.83 113.51,18.26 v117,18.26 | v125.73,26.35 129.54,30.16 134.3,30.16 136.21,32.07 v147.16,32.07 | v161.29,30.96 160.81,30.48 R28.2
N$4  (via drill 0.4)
  Top 0.203: v82.87,4.6 80.96,4.6 79.53,3.17 74.3,3.17 v73.5,3.97
  Bottom 0.203: v82.87,4.6 83.66,4.6 83.82,4.76 87.47,4.76 IC2.13 | v73.5,3.97 73.5,5.24 R13.2
N$5  (via drill 0.4)
  Top 0.203: v76.36,5.4 v83.5,5.4
  Bottom 0.203: v83.5,5.4 87.47,5.4 IC2.12 | v76.36,5.4 75.25,5.4 R14.2
N$6
  Bottom 0.203: IC3.11 9.37,18.73 20,18.73 22.38,16.35 24.77,16.35 25.24,15.88 32.38,15.88 32.86,16.35 37.62,16.35 37.78,16.19 R1.2
N$7  (via drill 0.4)
  Top 0.203: v92.87,7.46 93.66,8.26 93.66,10.48 v90.81,13.34 | v89.22,20.16 v89.22,14.92
  Bottom 0.203: v92.87,7.46 91.6,6.19 87.63,6.19 IC2.11 | v89.22,14.92 v90.81,13.34 | v89.22,20.16 88.9,19.84 74.61,19.84 73.34,18.57 70.01,18.57 69.37,17.94 69.37,16.83 69.69,16.83 70.17,16.35 73.34,16.35 74.14,15.56 R15.2
N$8  (via drill 0.4)
  Top 0.203: v17.46,4.29 v7.62,14.13
  Bottom 0.203: v7.62,14.13 6.19,14.13 3.49,16.83 IC3.15 | v17.46,4.29 20.8,4.29 21.75,5.24 R12.2
N$9  (via drill 0.4)
  Top 0.203: v102.55,10.16 102.55,12.22 103.03,12.7 v103.03,17.94
  Bottom 0.203: v102.55,10.16 92.08,10.16 92.08,7.46 91.28,6.67 87.63,6.67 IC2.10 | v103.03,17.94 101.6,19.37 79.22,19.37 78.42,18.57 R16.2
N$10  (via drill 0.4)
  Top 0.203: v90.17,3.65 v90.17,7.46 | v80.17,2.86 79.85,2.86 79.69,2.7 73.18,2.7 61.59,14.29 60.96,14.29 60.01,13.34 v60.01,12.86
  Bottom 0.203: v90.17,7.46 87.63,7.46 IC2.9 | v90.17,3.65 90.01,3.49 81.44,3.49 81.28,3.65 80.96,3.65 v80.17,2.86 | v60.01,12.86 60.01,11.43 R17.2
N$11  (via drill 0.4)
  Top 0.203: v91.12,7.46 91.12,6.03 91.92,5.24 v91.92,2.54 | v81.12,2.86 80.33,2.06 60.96,2.06 58.26,4.76 v58.26,7.94
  Bottom 0.203: v91.12,7.46 90.33,8.26 90.01,8.26 89.85,8.1 87.63,8.1 IC2.8 | v91.92,2.54 91.6,2.86 v81.12,2.86 | v58.26,7.94 58.26,10.16 R18.2
N$12  (via drill 0.4)
  Top 0.203: v83.5,7.94 81.6,7.94 v79.69,9.84 | v70.17,11.27 64.14,17.3 v64.14,21.59 | v54.93,22.7 51.59,26.04 51.59,26.83 v53.82,29.05
  Bottom 0.203: v83.5,7.94 85.72,7.94 86.36,8.57 87.47,8.57 IC2.7 | v79.69,9.84 76.83,9.84 75.41,11.27 v70.17,11.27 | v64.14,21.59 62.55,23.18 59.69,23.18 59.21,22.7 v54.93,22.7 | v53.82,29.05 53.98,29.21 R19.2
N$13  (via drill 0.4)
  Top 0.203: v23.65,26.99 v16.19,19.53
  Bottom 0.203: v16.19,19.53 9.37,19.53 IC3.10 | v23.65,26.99 23.65,31.59 35.88,31.59 37.78,33.5 R2.2
N$14  (via drill 0.4)
  Top 0.203: v14.76,17.14 v11.59,20.32
  Bottom 0.203: v11.59,20.32 11.43,20.16 9.37,20.16 IC3.9 | v14.76,17.14 15.08,16.83 20.64,16.83 21.91,15.56 21.91,13.49 26.83,13.49 30.16,10.16 50.8,10.16 51.44,9.53 52.07,9.53 53.98,11.43 57.63,11.43 62.07,15.88 67.94,15.88 68.42,16.35 69.37,16.35 71.75,13.97 R31.2
N$15  (via drill 0.4)
  Top 0.203: v6.99,22.54 6.99,26.04 v13.18,32.23
  Bottom 0.203: v6.99,22.54 8.73,20.8 9.21,20.8 IC3.8 | v13.18,32.23 16.83,35.88 71.12,35.88 73.34,33.66 R32.2
N$16  (via drill 0.4)
  Top 0.203: v21.11,18.57 21.11,17.94 16.03,12.86 16.03,12.06 16.67,11.43 25.72,11.43 28.1,13.81 31.43,13.81 35.56,9.68 46.04,9.68 v50.8,4.92 | v62.07,7.94 v59.05,4.92
  Bottom 0.203: v21.11,18.57 19.37,20.32 12.54,20.32 11.59,21.27 9.37,21.27 IC3.7 | v59.05,4.92 v50.8,4.92 | v62.07,7.94 60.48,7.94 59.53,8.89 R33.2
N$17  (via drill 0.4)
  Top 0.203: v52.86,32.54 v47.94,27.62
  Bottom 0.203: v47.94,27.62 34.13,27.62 27.46,20.95 12.54,20.95 11.59,21.91 9.37,21.91 IC3.6 | v52.86,32.54 53.34,32.07 57.78,32.07 59.37,30.48 R34.2
N$18  (via drill 0.4)
  Top 0.203: v17.3,5.4 v8.57,14.13
  Bottom 0.203: v8.57,14.13 5.24,17.46 3.49,17.46 IC3.16 | v17.3,5.4 20,5.4 R11.2
N$19  (via drill 0.4)
  Top 0.203: v88.58,9.53 85.41,9.53 84.77,8.89 84.77,4.6 v80.8,0.64 | v57.47,1.27 57.47,2.38 51.59,8.26 v51.59,10.48 | v49.85,12.22 49.85,26.04 v51.75,27.94
  Bottom 0.203: v88.58,9.53 87.79,9.53 87.63,9.37 IC2.6 | v80.8,0.64 80.49,0.95 57.78,0.95 v57.47,1.27 | v49.85,12.22 v51.59,10.48 | R20.2 v51.75,27.94
N$20  (via drill 0.4)
  Top 0.203: v45.4,11.27 v52.55,4.13 | v45.4,21.75 v45.4,17.3
  Bottom 0.203: v52.55,4.13 56.83,4.13 57.78,3.17 79.53,3.17 80.49,4.13 81.6,4.13 IC2.15 | v45.4,17.3 v45.4,11.27 | v45.4,21.75 43.97,23.18 39.69,23.18 R26.2
N$21  (via drill 0.4)
  Top 0.203: v76.99,4.6 73.82,4.6 73.03,5.4 v72.23,5.4 | v69.85,6.99 69.53,6.99 v60.8,15.72
  Bottom 0.203: v76.99,4.6 77.79,5.4 79.38,5.4 79.85,4.92 81.6,4.92 IC2.16 | v72.23,5.4 72.23,6.99 v69.85,6.99 | v60.8,15.72 60.01,16.51 50.48,16.51 46.04,20.95 40.01,20.95 37.94,23.02 R25.2
N$22  (via drill 0.4)
  Top 0.203: v70.64,6.19 v76.99,6.19
  Bottom 0.203: v76.99,6.19 79.22,6.19 79.85,5.56 81.6,5.56 IC2.17 | v70.64,6.19 70.17,5.71 39.69,5.71 39.37,5.4 R24.2
N$23
  Bottom 0.203: IC2.18 81.6,6.19 80.96,6.19 80.49,6.67 78.42,6.67 75.41,9.68 65.41,9.68 61.91,6.19 43.34,6.19 39.85,9.68 34.45,9.68 33.81,9.05 33.81,5.4 37.31,5.4 R23.2
N$24  (via drill 0.4)
  Top 0.203: v82.87,6.67 81.92,6.67 v77.95,10.64 | v77.47,13.02 80.96,16.51 v81.12,16.51 | v92.87,12.22 v92.87,15.4 | v114.94,14.61 118.43,18.1 118.43,18.41 125.41,25.4 v125.89,25.4
  Bottom 0.203: v82.87,6.67 81.76,6.67 IC2.19 | v77.95,10.64 77.95,11.11 77.47,11.59 v77.47,13.02 | v81.12,16.51 89.22,16.51 90.33,15.4 v92.87,15.4 | v92.87,12.22 93.19,11.91 104.3,11.91 106.2,13.81 114.14,13.81 v114.94,14.61 | v125.89,25.4 127.64,27.15 127.64,27.62 129.7,29.69 135.25,29.69 136.84,31.27 154.78,31.27 155.26,31.75 156.69,31.75 156.84,31.59 160.97,31.59 161.13,31.75 161.45,31.75 162.08,31.11 162.08,29.21 R8.2
N$25  (via drill 0.4)
  Top 0.203: v80.17,7.46 76.99,10.64 v76.99,11.11 | v80.33,14.76 82.07,16.51 v82.07,17.3 | v94.14,16.51 94.14,14.92 99.69,9.37 v99.69,7.62 | v149.22,0.64 160.97,12.38 v160.97,26.67
  Bottom 0.203: v80.17,7.46 81.6,7.46 IC2.20 | v76.99,11.11 76.99,12.54 76.68,12.86 76.68,13.81 78.26,13.81 79.22,14.76 v80.33,14.76 | v82.07,17.3 83.66,18.89 91.76,18.89 v94.14,16.51 | v99.69,7.62 100.01,7.3 117.63,7.3 124.3,0.64 v149.22,0.64 | v160.97,26.67 159.7,27.94 R7.2
N$26  (via drill 0.4)
  Top 0.203: v86.36,6.67 88.42,4.6 89.06,4.6 89.53,5.08 89.53,7.14 89.38,7.3 89.38,7.62 90.17,8.41 v92.87,8.41 | v109.22,10 v107.63,8.41 | v118.9,10 118.9,10.32 v122.71,14.13
  Bottom 0.203: v86.36,6.67 83.82,6.67 82.55,7.94 81.76,7.94 IC2.21 | v107.63,8.41 v92.87,8.41 | v118.9,10 v109.22,10 | v122.71,14.13 127.48,14.13 129.22,15.88 143.51,15.88 146.05,13.34 146.05,11.43 R6.2
N$27  (via drill 0.4)
  Top 0.203: v85.57,8.73 85.57,6.67 85.25,6.35 v85.25,0.64 | v104.14,1.91 109.54,7.3 v124.14,7.3 | v132.4,7.3 133.19,7.3 v136.53,10.64
  Bottom 0.203: v85.57,8.73 81.76,8.73 IC2.22 | v85.25,0.64 85.41,0.48 102.71,0.48 v104.14,1.91 | v132.4,7.3 v124.14,7.3 | v136.53,10.64 136.84,10.32 156.05,10.32 157.48,8.89 R5.2
N$28  (via drill 0.4)
  Top 0.203: v9.37,15.88 v7.14,18.1
  Bottom 0.203: v7.14,18.1 3.49,18.1 IC3.17 | v9.37,15.88 14.61,15.88 15.08,16.35 19.53,16.35 20,15.88 R10.2
N$29  (via drill 0.4)
  Top 0.203: v14.61,13.34 15.56,13.34 20.32,18.1 20.32,21.11 v21.27,22.07
  Bottom 0.203: v14.61,13.34 2.54,13.34 2.54,18.41 2.86,18.73 3.33,18.73 IC3.18 | v21.27,22.07 21.27,23.18 21.75,23.18 R9.2
N$30  (via drill 0.4)
  Top 0.203: v5.08,19.53 9.53,23.97 v9.53,26.04
  Bottom 0.203: v5.08,19.53 3.49,19.53 IC3.19 | v9.53,26.04 9.68,26.19 15.88,26.19 18.73,23.34 19.68,23.34 R22.2
N$31  (via drill 0.4)
  Top 0.203: v2.38,20.16 2.38,21.75 3.81,23.18 3.81,24.29 v10.95,31.43
  Bottom 0.203: v2.38,20.16 3.33,20.16 IC3.20 | v10.95,31.43 17.94,31.43 20,33.5 R21.2
SDI_MOSI  (via drill 0.4)
  Top 0.203: v97.16,20.16 97.63,19.68 98.27,19.68 100.65,17.3 100.65,15.56 99.85,14.76 99.06,14.76 97.95,15.88 97.63,15.88 SSW1.6 | v98.42,21.11 98.42,24.77 97.63,25.56 SSW1ALT.6 | v100.17,31.75 97.63,34.29 97.63,35.24 SSW2.6 | v101.76,27.94 101.76,24.61 100.01,22.86 v100.01,21.11 | v137.64,29.37 133.51,33.5 122.08,33.5 116.2,27.62 116.2,27.3 115.09,26.19 v114.78,26.19
  Bottom 0.203: v97.16,20.16 98.11,21.11 v98.42,21.11 v100.01,21.11 | v100.17,31.75 101.76,30.16 v101.76,27.94 103.82,25.88 114.46,25.88 v114.78,26.19 | v137.64,29.37 137.79,29.53 139.86,29.53 141.13,28.26 SERIAL1.8
SDI_SCLK  (via drill 0.4)
  Top 0.203: v103.98,24.45 103.98,24.77 v102.55,26.19 | v100.97,30 100.97,35.4 99.06,37.31 98.58,37.31 SSW2.7 | v115.41,27.46 121.92,33.97 133.99,33.97 138.59,29.37 138.59,28.26 SERIAL1.7 | v114.3,23.5 v116.36,25.56
  Bottom 0.203: v103.98,24.45 103.98,23.81 | 103.98,23.81 103.98,17.78 103.35,17.14 99.22,17.14 98.58,17.78 SSW1.7 | v102.55,26.19 101.12,27.62 100.97,27.62 | 100.97,27.62 98.58,27.62 SSW1ALT.7 | 100.97,27.62 v100.97,30 | v115.41,27.46 115.41,26.51 v116.36,25.56 | v114.3,23.5 113.98,23.81 103.98,23.81
SSGPA0  (via drill 0.4)
  Top 0.203: v121.13,5.4 114.3,5.4 112.87,6.83 110.01,6.83 106.52,3.33 106.52,1.27 105.73,0.48 97.16,0.48 94.3,3.33 SSW1.2 94.14,3.49 94.14,13.02 SSW1ALT.2
  Bottom 0.203: v121.13,5.4 133.67,5.4 IC4.21
SSGPA1  (via drill 0.4)
  Top 0.203: v117.79,9.21 117.79,9.53 113.35,13.97 113.35,18.57 113.03,18.89 113.03,20.64 114.3,21.91 114.3,22.54 v115.25,23.5 | v114.3,24.45 114.3,24.92 112.71,26.51 112.71,29.37 105.89,36.2 101.28,36.2 98.9,38.58 94.14,38.58 v93.03,37.47 | v93.03,34.29 93.03,33.66 91.12,31.75 91.12,28.26 93.66,25.72 93.66,23.5 94.14,23.02 SSW2.2
  Bottom 0.203: v117.79,9.21 119.38,7.62 119.86,7.62 121.44,6.03 133.67,6.03 IC4.22 | v114.3,24.45 v115.25,23.5 | v93.03,34.29 v93.03,37.47
SSGPB0  (via drill 0.4)
  Top 0.203: v102.55,25.24 102.55,24.29 104.3,22.54 v105.73,22.54
  Bottom 0.203: 106.52,15.4 100.01,15.4 99.54,15.88 SSW1.8 | 106.52,15.4 117.63,15.4 119.7,13.34 127.32,13.34 127.79,13.81 128.11,13.81 130.65,11.27 134.46,11.27 135.89,9.84 140.97,9.84 IC4.1 | v102.55,25.24 99.85,25.24 99.54,25.56 SSW1ALT.8 | v105.73,22.54 106.52,21.75 106.52,15.4
SSGPB1  (via drill 0.4)
  Top 0.203: v119.06,8.89 113.82,14.13 v113.82,19.05 | v109.38,23.02 109.38,25.88 108.43,26.83 v108.43,28.1
  Bottom 0.203: v119.06,8.89 119.86,8.1 128.75,8.1 130.97,10.32 134.78,10.32 135.89,9.21 140.97,9.21 IC4.2 | v113.82,19.05 112.55,20.32 112.08,20.32 v109.38,23.02 | v108.43,28.1 101.28,35.24 99.54,35.24 SSW2.8

### Text on the board
_bsilk: GITHUB: SKAARHOJ-Open-Engineering | SKAARHOJ 2015 | PCB-CMB-4x | v07-01-13 | BI8-2x4RGB | v06-15